# Altium schematic sheet Topdesign.SchDoc
size A4; SheetNumber: 1; SheetTotal: 5
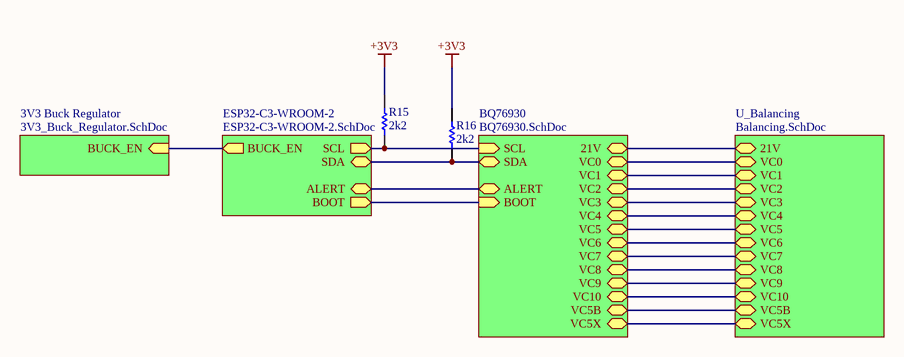
[diagram p0: Topdesign.SchDoc]

## Parts
R15  value 2k2  [Wurth 0603 Resistor]  (hidden comment: Generic Resistor 2k2 0603)
R16  value 2k2  [Wurth 0603 Resistor]  (hidden comment: Generic Resistor 2k2 0603)

## Sub-sheets
3V3 Buck Regulator = 3V3_Buck_Regulator.SchDoc: BUCK_EN (in)
BQ76930 = BQ76930.SchDoc: SCL (in), SDA (bidir), BOOT (in), ALERT (bidir), VC5X (bidir), VC0 (bidir), VC1 (bidir), VC2 (bidir), VC3 (bidir), VC4 (bidir), VC5 (bidir), VC6 (bidir), VC7 (bidir), VC8 (bidir), VC9 (bidir), VC10 (bidir), VC5B (bidir), 21V (bidir)
ESP32-C3-WROOM-2 = ESP32-C3-WROOM-2.SchDoc: SCL (out), SDA (bidir), ALERT (bidir), BOOT (out), BUCK_EN (out)
U_Balancing = Balancing.SchDoc: VC0 (bidir), VC1 (bidir), VC2 (bidir), VC3 (bidir), VC4 (bidir), VC5 (bidir), VC6 (bidir), VC7 (bidir), VC8 (bidir), VC9 (bidir), VC10 (bidir), VC5B (bidir), 21V (bidir), VC5X (bidir)

## Nets
+3V3: R15.2 R16.2
NetR15_1: R15.1 ; sheet ESP32-C3-WROOM-2/SCL, sheet BQ76930/SCL
NetR16_1: R16.1 ; sheet ESP32-C3-WROOM-2/SDA, sheet BQ76930/SDA
(unnamed): sheet ESP32-C3-WROOM-2/ALERT, sheet BQ76930/ALERT
(unnamed): sheet ESP32-C3-WROOM-2/BOOT, sheet BQ76930/BOOT
(unnamed): sheet ESP32-C3-WROOM-2/BUCK_EN, sheet 3V3 Buck Regulator/BUCK_EN
(unnamed): sheet BQ76930/VC5X, sheet U_Balancing/VC5X
(unnamed): sheet BQ76930/VC0, sheet U_Balancing/VC0
(unnamed): sheet BQ76930/VC1, sheet U_Balancing/VC1
(unnamed): sheet BQ76930/VC2, sheet U_Balancing/VC2
(unnamed): sheet BQ76930/VC3, sheet U_Balancing/VC3
(unnamed): sheet BQ76930/VC4, sheet U_Balancing/VC4
(unnamed): sheet BQ76930/VC5, sheet U_Balancing/VC5
(unnamed): sheet BQ76930/VC6, sheet U_Balancing/VC6
(unnamed): sheet BQ76930/VC7, sheet U_Balancing/VC7
(unnamed): sheet BQ76930/VC8, sheet U_Balancing/VC8
(unnamed): sheet BQ76930/VC9, sheet U_Balancing/VC9
(unnamed): sheet BQ76930/VC10, sheet U_Balancing/VC10
(unnamed): sheet BQ76930/VC5B, sheet U_Balancing/VC5B
(unnamed): sheet BQ76930/21V, sheet U_Balancing/21V